# Altium schematic sheet pwr_ctl.SchDoc: USB Battery Charger w/Solar In
size B; Engineer: Michael J. Kelly; Organization: CSB540otn - Outernet; Address1: AM335x Compute Board; Address2: (C) 2015; Address3: All Rights Reserved; Address4: www.cogcomp.com; DocumentNumber: 7; Revision: P1; SheetNumber: 7; SheetTotal: 9
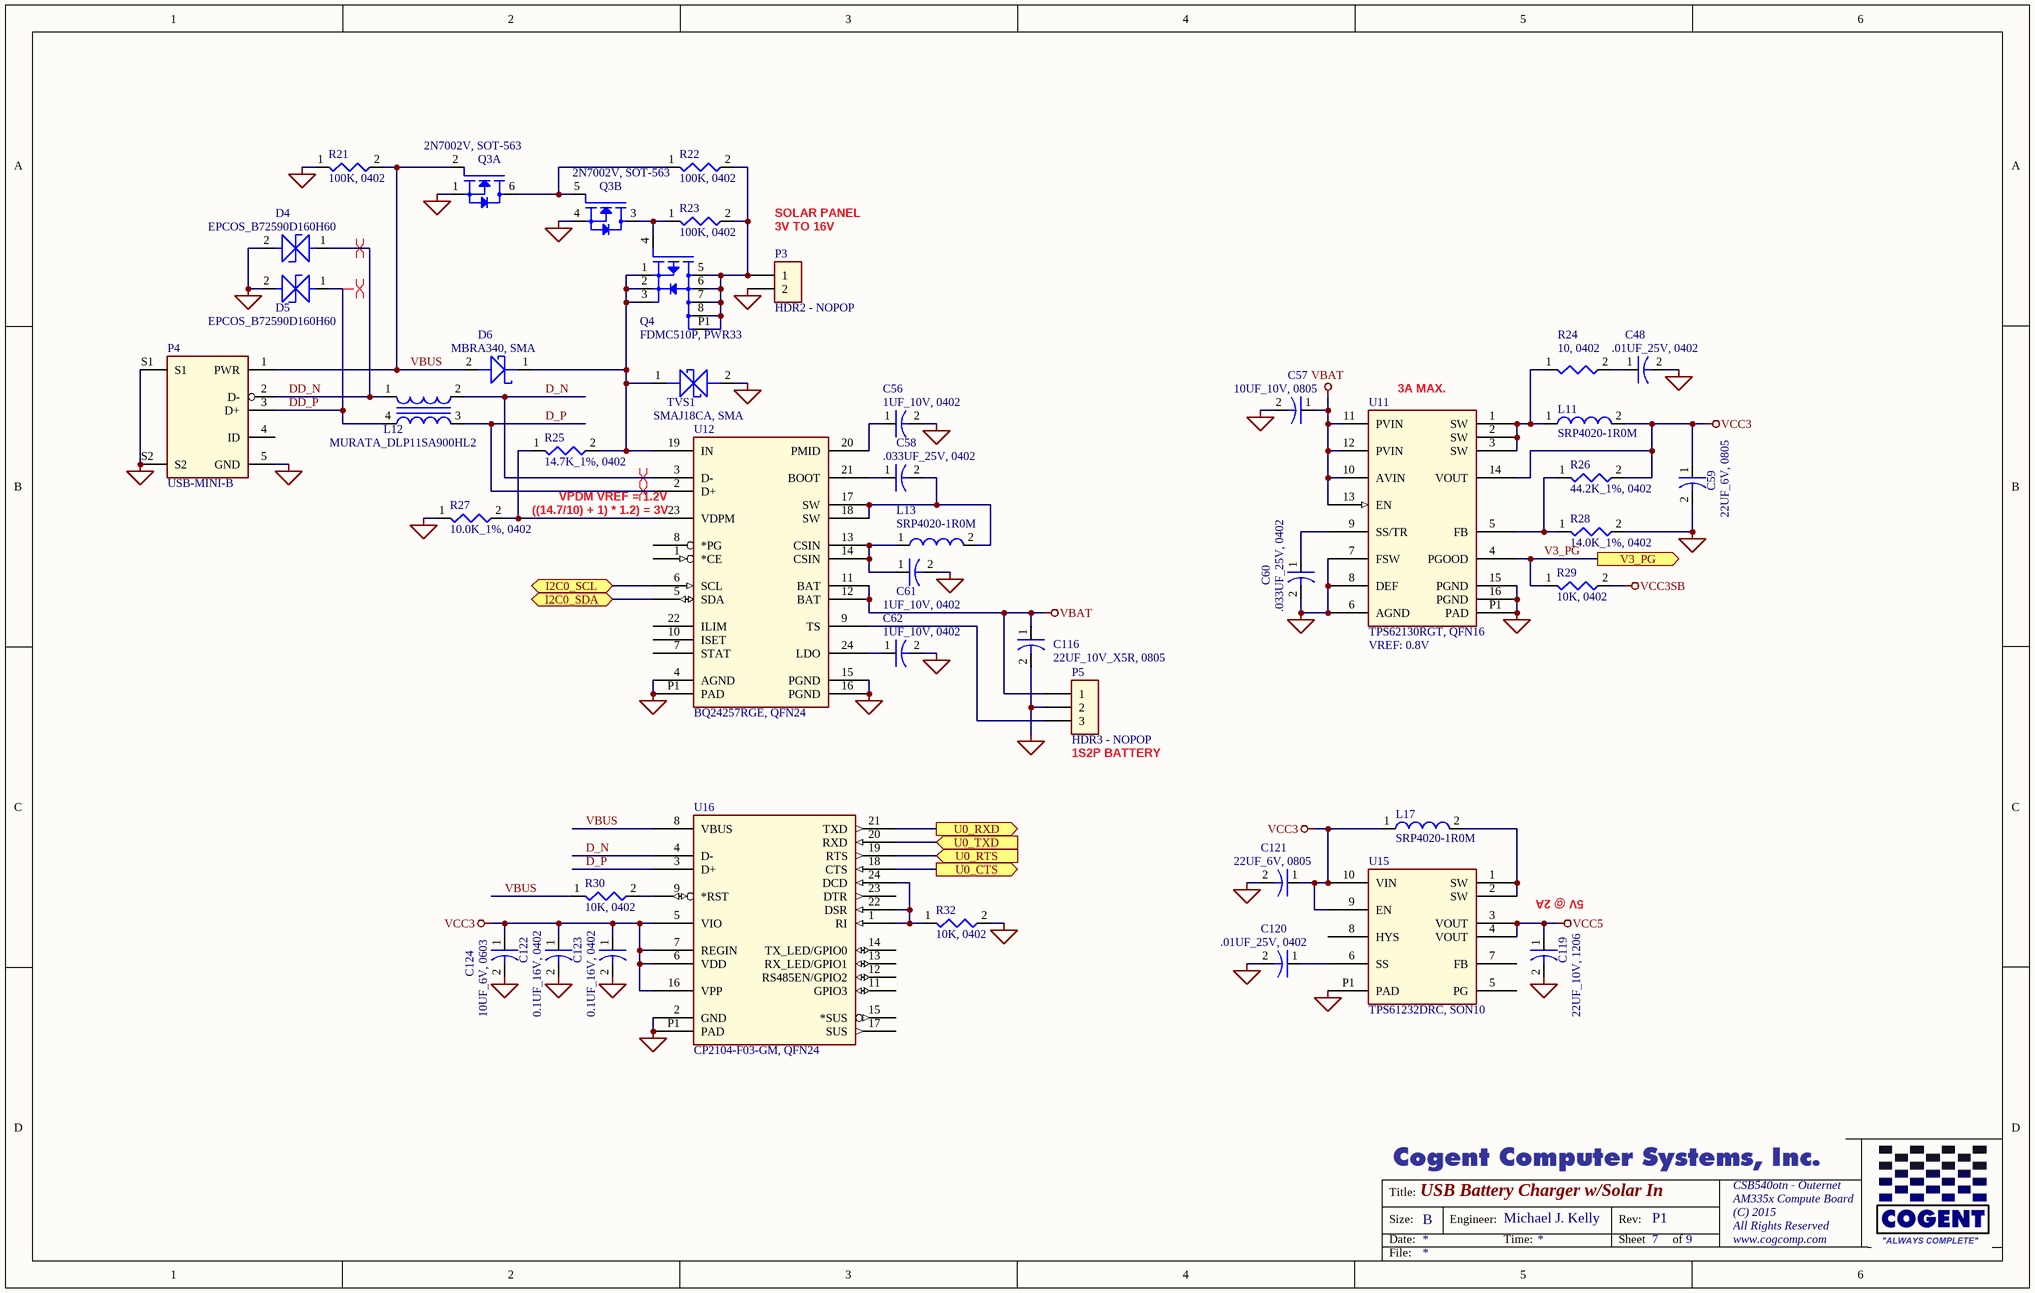
[diagram p0: pwr_ctl.SchDoc]

## Parts
C48  .01UF_25V, 0402  [0402C]
C56  1UF_10V, 0402  [0402C]
C57  10UF_10V, 0805  [0805C]
C58  .033UF_25V, 0402  [0402C]
C59  22UF_6V, 0805  [0805C]
C60  .033UF_25V, 0402  [0402C]
C61  1UF_10V, 0402  [0402C]
C62  1UF_10V, 0402  [0402C]
C116  22UF_10V_X5R, 0805  [0805C]
C119  22UF_10V, 1206  [1206C]
C120  .01UF_25V, 0402  [0402C]
C121  22UF_6V, 0805  [0805C]
C122  0.1UF_16V, 0402  [0402C]
C123  0.1UF_16V, 0402  [0402C]
C124  10UF_6V, 0603  [0603C]
D4  EPCOS_B72590D160H60  [0402L]
D5  EPCOS_B72590D160H60  [0402L]
D6  MBRA340, SMA  [SMA]
L11  SRP4020-1R0M  [SRP4020]
L12  MURATA_DLP11SA900HL2  [PANASONIC_EXC24C]
L13  SRP4020-1R0M  [SRP4020]
L17  SRP4020-1R0M  [SRP4020]
P3  HDR2 - NOPOP  [HDR2X1-NOPOP]
P4  USB-MINI-B  [USB-MINI-B]
P5  HDR3 - NOPOP  [HDR3X1-NOPOP]
Q3  2N7002V, SOT-563  [SOT-563]  (parts A,B of 2)
Q4  FDMC510P, PWR33  [POWER-33]
R21  100K, 0402  [0402R]
R22  100K, 0402  [0402R]
R23  100K, 0402  [0402R]
R24  10, 0402  [0402R]
R25  14.7K_1%, 0402  [0402R]
R26  44.2K_1%, 0402  [0402R]
R27  10.0K_1%, 0402  [0402R]
R28  14.0K_1%, 0402  [0402R]
R29  10K, 0402  [0402R]
R30  10K, 0402  [0402R]
R32  10K, 0402  [0402R]
TVS1  SMAJ18CA, SMA  [SMA]
U11  TPS62130RGT, QFN16  VREF: 0.8V  [QFN16-3MM]
U12  BQ24257RGE, QFN24  [QFN24]
U15  TPS61232DRC, SON10  [SON10]
U16  CP2104-F03-GM, QFN24  [QFN24]

## Ports
I2C0_SCL (bidir), I2C0_SDA (bidir), U0_CTS (out), U0_RTS (in), U0_RXD (out), U0_TXD (in), V3_PG (out)

## Nets
GND: C48.2 C56.2 C57.2 C59.2 C60.2 C61.2 C62.2 C116.2 C119.2 C120.2 C121.2 C122.2 C123.2 C124.2 D4.2(CATHODE) D5.2(CATHODE) P3.2 P4.5(GND) P4.S1 P4.S2 P5.2 Q3.1 Q3.4 R21.1 R27.1 R28.2 R32.2 TVS1.2 U11.6(AGND) U11.7(FSW) U11.8(DEF) U11.15(PGND) U11.16(PGND) U11.P1(PAD) U12.4(AGND) U12.15(PGND) U12.16(PGND) U12.P1(PAD) U15.P1(PAD) U16.2(GND) U16.P1(PAD)
VBAT: C57.1 C116.1 P5.1 U11.10(AVIN) U11.11(PVIN) U11.12(PVIN) U11.13(EN) U12.11(BAT) U12.12(BAT)
VCC3: C59.1 C121.1 C122.1 C123.1 C124.1 L11.2 L17.1 R26.2 U11.14(VOUT) U15.9(EN) U15.10(VIN) U16.5(VIO) U16.6(VDD) U16.7(REGIN) U16.16(VPP)
VCC3SB: R29.2
VCC5: C119.1 U15.3(VOUT) U15.4(VOUT)
D_N: L12.2 U12.3(D-) U16.4(D-)
D_P: L12.3 U12.2(D+) U16.3(D+)
DD_N: D4.1(ANODE) L12.1 P4.2(D-)
DD_P: D5.1(ANODE) L12.4 P4.3(D+)
I2C0_SCL: U12.6(SCL) ; port I2C0_SCL
I2C0_SDA: U12.5(SDA) ; port I2C0_SDA
U0_CTS: U16.18(CTS) ; port U0_CTS
U0_RTS: U16.19(RTS) ; port U0_RTS
U0_RXD: U16.21(TXD) ; port U0_RXD
U0_TXD: U16.20(RXD) ; port U0_TXD
V3_PG: R29.1 U11.4(PGOOD) ; port V3_PG
VBUS: D6.2(ANODE) P4.1(PWR) Q3.2 R21.2 R30.1 U16.8(VBUS)
NetC48_1: C48.1 R24.2
NetC56_1: C56.1 U12.20(PMID)
NetC58_1: C58.1 U12.21(BOOT)
NetC58_2: C58.2 L13.2 U12.17(SW) U12.18(SW)
NetC60_1: C60.1 U11.9(SS/TR)
NetC61_1: C61.1 L13.1 U12.13(CSIN) U12.14(CSIN)
NetC62_1: C62.1 U12.24(LDO)
NetC120_1: C120.1 U15.6(SS)
NetD6_1: D6.1(CATHODE) Q4.1 Q4.2 Q4.3 R25.2 TVS1.1 U12.19(IN)
NetL11_1: L11.1 R24.1 U11.1(SW) U11.2(SW) U11.3(SW)
NetL17_2: L17.2 U15.1(SW) U15.2(SW)
NetP3_1: P3.1 Q4.5 Q4.6 Q4.7 Q4.8 Q4.P1(PAD) R22.2 R23.2
NetP5_3: P5.3 U12.9(TS)
NetQ3_3: Q3.3 Q4.4 R23.1
NetQ3_5: Q3.5 Q3.6 R22.1
NetR25_1: R25.1 R27.2 U12.23(VDPM)
NetR26_1: R26.1 R28.1 U11.5(FB)
NetR30_2: R30.2 U16.9(*RST)
NetR32_1: R32.1 U16.1(RI) U16.22(DSR) U16.24(DCD)

Not connected (* = marked no-connect by the designer): P4 4(ID); U12 1(*CE) 7(STAT) 8(*PG) 10(ISET) 22(ILIM); U15 5(PG) 7(FB) 8(HYS); U16 11(GPIO3) 12(RS485EN/GPIO2) 13(RX_LED/GPIO1) 14(TX_LED/GPIO0) 15(*SUS) 17(SUS) 23(DTR)

## Layout directives
differential pair: D_N, D_P, DD_N, DD_P

## Notes on the sheet
- SOLAR PANEL
- 3V TO 16V
- (near U11) 3A MAX.
- VPDM VREF = 1.2V
- (near U12) ((14.7/10) + 1) * 1.2) = 3V
- (near P5) 1S2P BATTERY
- (near C119) 5V @ 2A
- Title:
- Size:
- Date:
- B
- Engineer:
- Time:
- Rev:
- Sheet
- of
- File:

## Library data of the parts
C48 C120 = .01UF_25V, 0402: CAP - 0402 PKG
C56 C61 C62 = 1UF_10V, 0402: CAP - 0402 PKG
C57 = 10UF_10V, 0805: CAP - 0805 PKG
C58 C60 = .033UF_25V, 0402: CAP - 0402 PKG
C59 C121 = 22UF_6V, 0805: CAP - 0805 PKG
C116 = 22UF_10V_X5R, 0805: CAP - 0805 PKG
C119 = 22UF_10V, 1206: CAP - 1206 PKG
C122 C123 = 0.1UF_16V, 0402: CAP - 0402 PKG
C124 = 10UF_6V, 0603: CAP - 0603 PKG
D4 D5 = EPCOS_B72590D160H60: DIODE - VARISTOR, 16VDC 2PF 0402; NOTE1: STACKPOLE ESD02A12VR17V
D6 = MBRA340, SMA: DIODE - POWER, SCHOTTKY, 40V, 3A
L11 L13 L17 = SRP4020-1R0M: INDUCTOR - 1.0UH, 5/6A, 4MM x 4MM x 2MM, 22mohm
L12 = MURATA_DLP11SA900HL2: FERRITE - COMMON MODE FILTER, USB2/HDMI/GIGe, FILM
P3 = HDR2 - NOPOP: HEADER - 2-PIN, HOLES ONLY FOR WIRE
P4 = USB-MINI-B: CONN - USB TYPE B MINI
P5 = HDR3 - NOPOP: HEADER - 3-PIN, HOLES ONLY FOR WIRE
Q3 = 2N7002V, SOT-563: N-FET - DUAL, 60V, 500ma @ 10V, Vgs(th) 2V
Q4 = FDMC510P, PWR33: P-FET - 20V, 8.3A @ 1.5Vgs, 17mohm
R21-R23 = 100K, 0402: RES - 0402 PKG
R24 = 10, 0402: RES - 0402 PKG
R25 = 14.7K_1%, 0402: RES - 0402 PKG
R26 = 44.2K_1%, 0402: RES - 0402 PKG
R27 = 10.0K_1%, 0402: RES - 0402 PKG
R28 = 14.0K_1%, 0402: RES - 0402 PKG
R29 R30 R32 = 10K, 0402: RES - 0402 PKG
TVS1 = SMAJ18CA, SMA: DIODE - TVS, 20V MIN., 22.1V MAX.
U11 = TPS62130RGT, QFN16: SWITCHER - 17ua Iq, 3A, 3V TO 17V IN, 0.9V TO 6V OUT
U12 = BQ24257RGE, QFN24: IC - BATTERY CHARGER USB BC1.2, 1CELL, 2A
U15 = TPS61232DRC, SON10: SWITCHER - 500ua Iq, BOOST 5A, 2.3V TO 5.5V IN, 2.5V TO 5.5V OUT
U16 = CP2104-F03-GM, QFN24: USB - UART W/4 GPIO